# EAGLE design muscle_schematics (EAGLE 8.1.0)
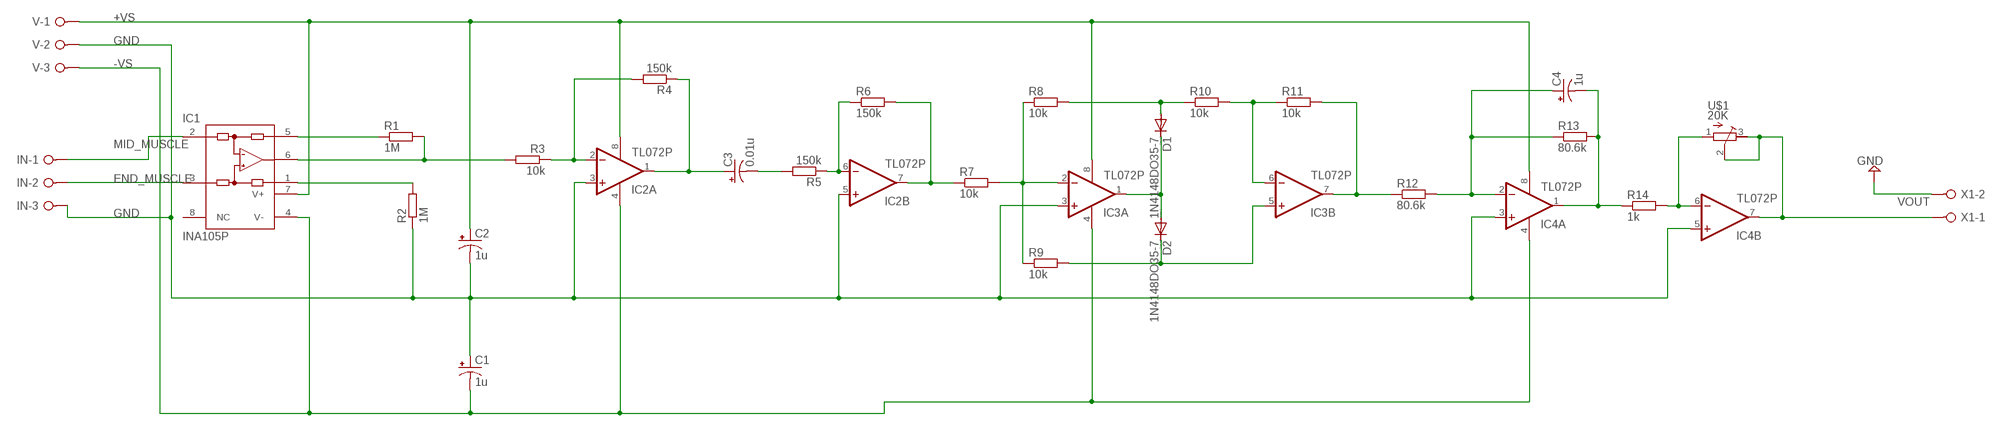
[diagram p0: schematic, sheet 1]

## Parts
C1  1u  CPOL-USE5-6  [E5-6]
C2  1u  CPOL-USE5-6  [E5-6]
C3  0.01u  CPOL-USE5-6  [E5-6]
C4  1u  CPOL-USE5-6  [E5-6]
D1  1N4148DO35-7  [DO35-7]
D2  1N4148DO35-7  [DO35-7]
IC1  INA105P  [DIL08]
IC2  TL072P  [DIL08]
IC3  TL072P  [DIL08]
IC4  TL072P  [DIL08]
IN  W237-3E  [W237-3E]
R1  1M  R-EU_0207/10  [0207/10]
R2  1M  R-EU_0207/10  [0207/10]
R3  10k  R-EU_0207/10  [0207/10]
R4  150k  R-EU_0207/10  [0207/10]
R5  150k  R-EU_0207/10  [0207/10]
R6  150k  R-EU_0207/10  [0207/10]
R7  10k  R-EU_0207/10  [0207/10]
R8  10k  R-EU_0207/10  [0207/10]
R9  10k  R-EU_0207/10  [0207/10]
R10  10k  R-EU_0207/10  [0207/10]
R11  10k  R-EU_0207/10  [0207/10]
R12  80.6k  R-EU_0207/10  [0207/10]
R13  80.6k  R-EU_0207/10  [0207/10]
R14  1k  R-EU_0207/10  [0207/10]
U$1  20K  R-TRIMM3339P  [RTRIM3339P]
V  W237-3E  [W237-3E]
X1  W237-02P  [W237-132]

## Nets
+VS: C2.+ IC1.7(V+) IC2.8(P:V+) IC3.8(P:V+) IC4.8(P:V+) V.1
-VS: C1.- IC1.4(V-) IC2.4(P:V-) IC3.4(P:V-) IC4.4(P:V-) V.3
END_MUSCLE: IC1.3(+IN) IN.2
GND: C1.+ C2.- IC2.3(A:+IN) IC2.5(B:+IN) IC3.3(A:+IN) IC4.3(A:+IN) IC4.5(B:+IN) IN.3 R2.1 V.2 X1.2
MID_MUSCLE: IC1.2(-IN) IN.1
N$1: IC1.5(SENSE) R1.1
N$2: IC1.6(OUT) R1.2 R3.2
N$3: IC1.1(REF) R2.2
N$4: C3.+ IC2.1(A:OUT) R4.1
N$5: C3.- R5.2
N$6: IC2.2(A:-IN) R3.1 R4.2
N$7: IC2.6(B:-IN) R5.1 R6.1
N$8: IC3.6(B:-IN) R10.2 R11.1
N$9: IC3.2(A:-IN) R7.2 R8.1 R9.1
N$10: D1.A R8.2 R10.1
N$13: D2.C IC3.5(B:+IN) R9.2
N$14: IC2.7(B:OUT) R6.2 R7.1
N$15: IC3.7(B:OUT) R11.2 R12.1
N$17: D1.C D2.A IC3.1(A:OUT)
N$18: C4.+ IC4.2(A:-IN) R12.2 R13.1
N$19: IC4.6(B:-IN) R14.2 U$1.1(A)
N$20: C4.- IC4.1(A:OUT) R13.2 R14.1
VOUT: IC4.7(B:OUT) U$1.2(S) U$1.3(E) X1.1
Unconnected: IC1.8(NC)

## Library data of the parts
C1-C4 = rcl:CPOL-US: POLARIZED CAPACITOR, American symbol
D1 D2 = diode:1N4148: DIODE high speed (Philips)
IC1 = burr-brown:INA105: Precision Unity Gain Diff. Amplifier; MF: TEXAS INSTRUMENTS; MPN: INA105KP; OC_FARNELL: 1651850; OC_NEWARK: 04M4538
IC2-IC4 = linear:TL072: OP AMP
IN V = con-wago-508:W237-3E: WAGO SREW CLAMP; OC_FARNELL: unknown; OC_NEWARK: unknown
R1-R14 = resistor:R-EU_: RESISTOR, European symbol
U$1 = resistor:R-TRIMM: Trimm resistor
X1 = con-wago-508:W237-02P: WAGO SREW CLAMP; OC_FARNELL: unknown; OC_NEWARK: unknown

## Board
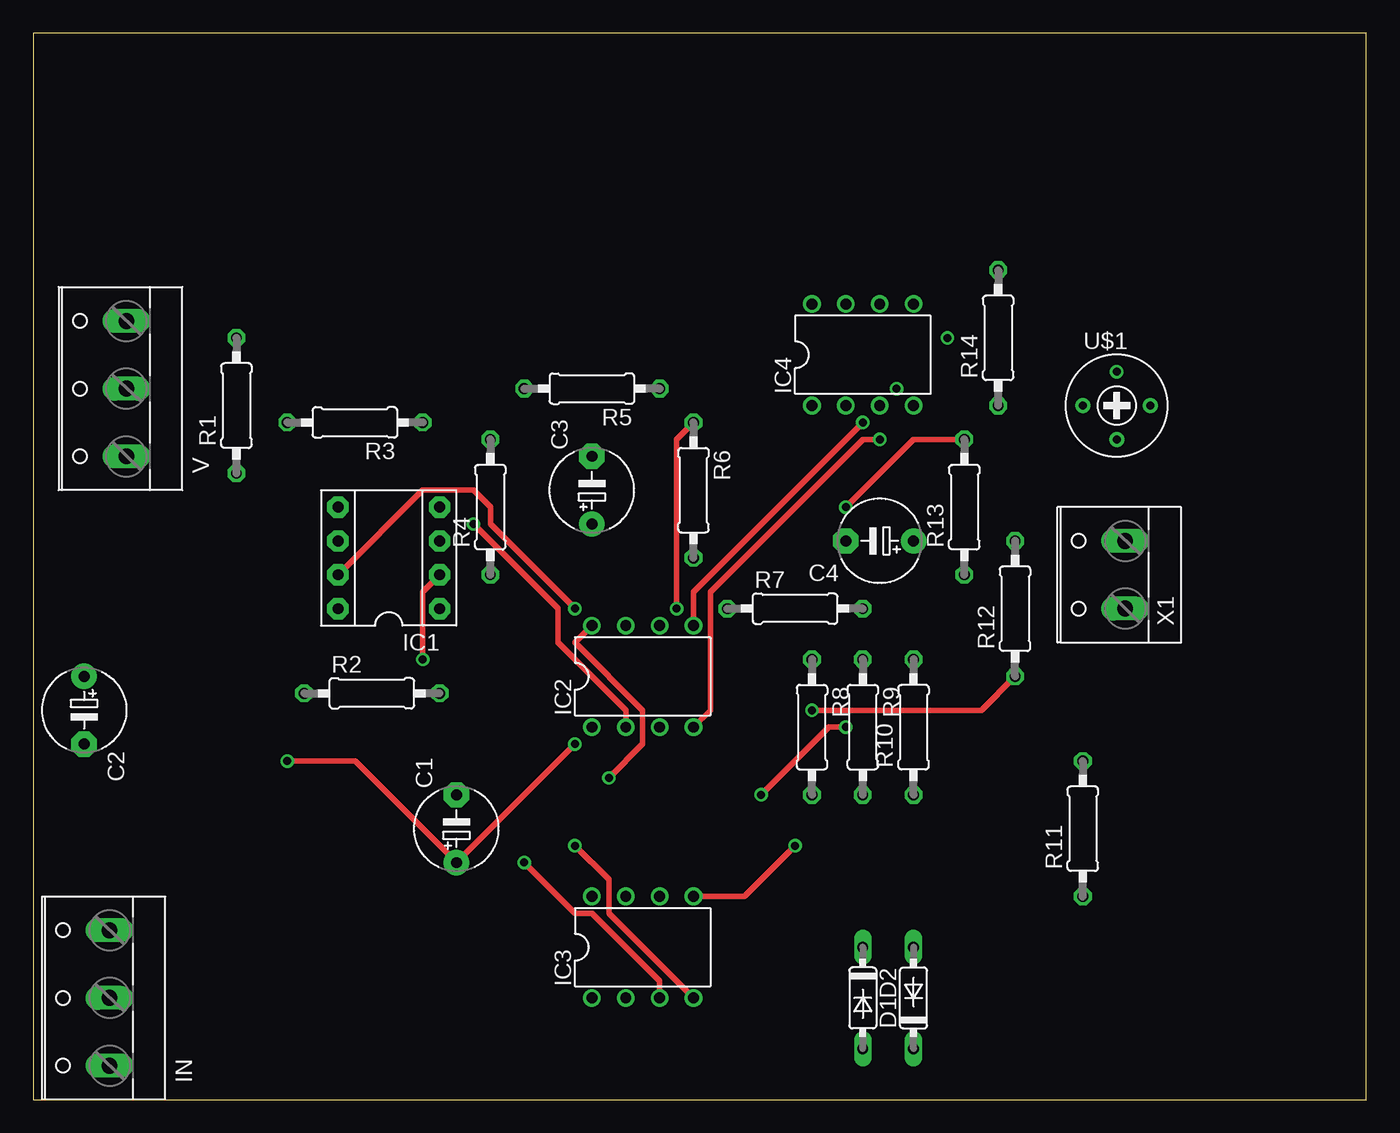
[diagram p1: board, top side]
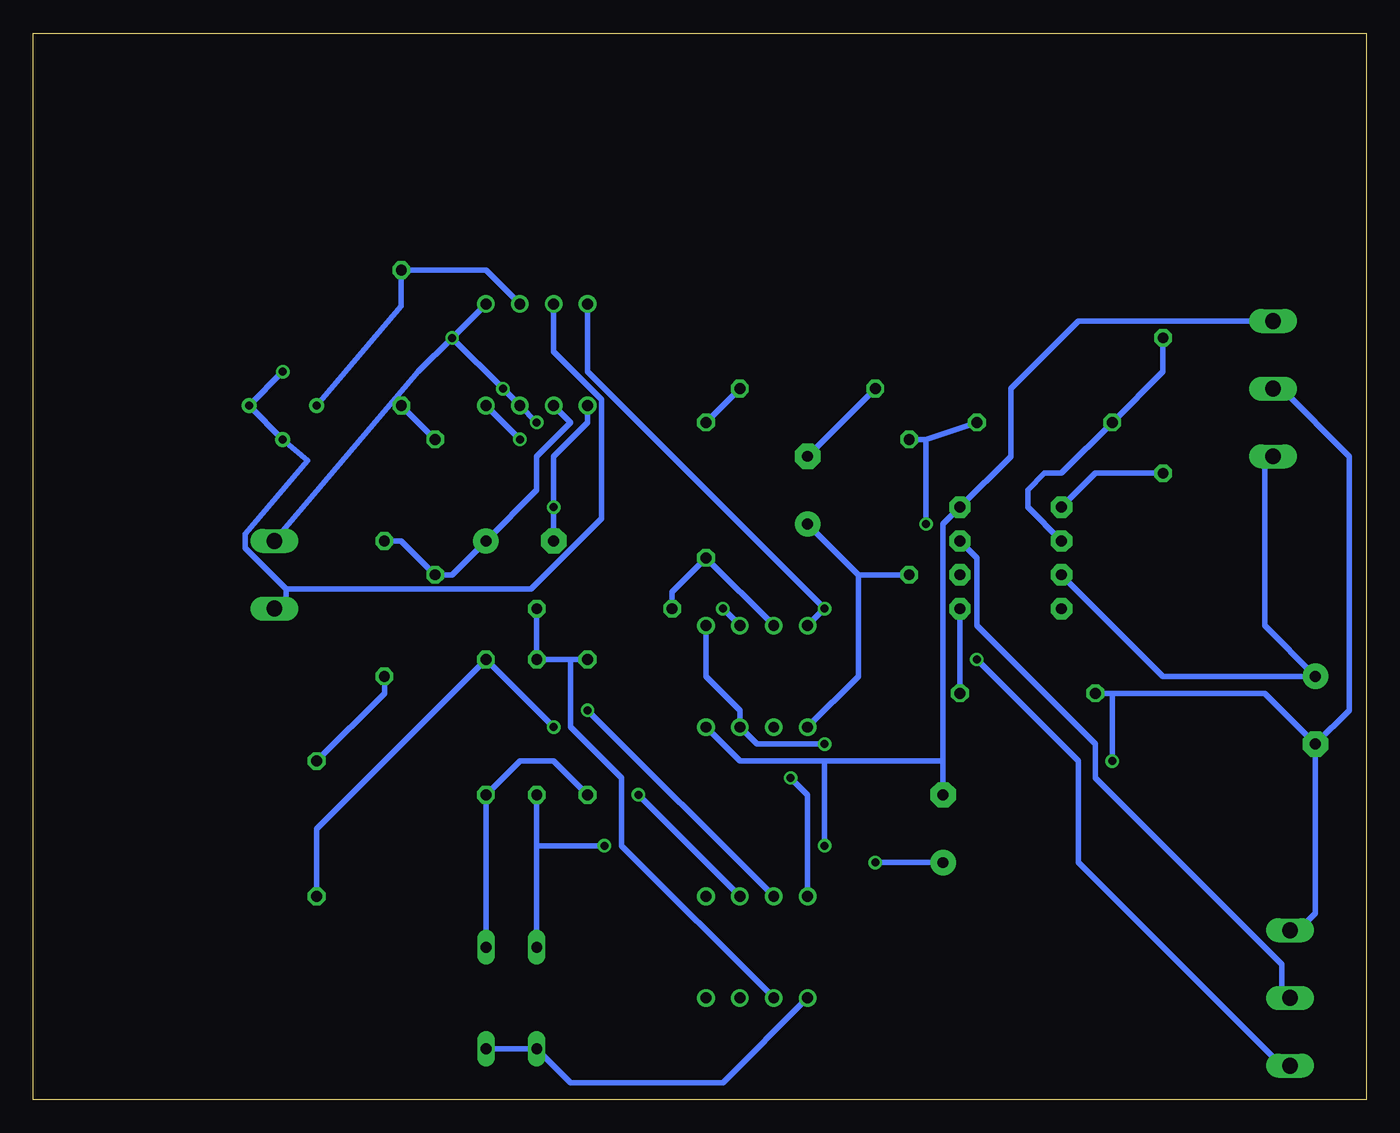
[diagram p2: board, bottom side, seen from below]

Size 100 x 80 mm. Coordinates in mm from the lower left corner, seen from the top.
Outline: 0,0 100,0 100,80 0,80 0,0
Copper layers (1*16): Top 0.035mm / dielectric 1.5mm / Bottom 0.035mm
Design rules "muscle_dru": minimum track width 10mil, minimum drill 24mil, track to track 8mil, track to pad 8mil, pad to pad 8mil, via to via 8mil, smd to smd 8mil, copper to edge 40mil, drill to drill 8mil, minimum pad ring 10mil, minimum via ring 8mil, stop-mask expansion 4mil, vias tented up to drill 0mil, thermal gap 10mil

### Footprints (pad centres in the part's own frame; a part is rotated, then mirrored left to right if it is on the bottom)
E5-6 = drill 0.813 pad 1.905: + -2.54,0 | drill 0.813 pad 1.905 octagon: - 2.54,0
DO35-7 = drill 0.813 long: A 3.81,0; C -3.81,0
DIL08 = drill 0.813 pad 1.6 octagon: 1 -3.81,-3.81; 2 -1.27,-3.81; 3 1.27,-3.81; 4 3.81,-3.81; 5 3.81,3.81; 6 1.27,3.81; 7 -1.27,3.81; 8 -3.81,3.81
DIL08' = drill 0.813 pad 1.27: 1 -3.81,-3.81; 2 -1.27,-3.81; 3 1.27,-3.81; 4 3.81,-3.81; 5 3.81,3.81; 6 1.27,3.81; 7 -1.27,3.81; 8 -3.81,3.81
W237-3E = drill 1.194 long: 1 -5.08,-0.635; 2 0,-0.635; 3 5.08,-0.635
0207/10 = drill 0.813 octagon: 1 -5.08,0; 2 5.08,0
RTRIM3339P = drill 0.61: 1 -2.54,0; 2 0,-2.54; 3 2.54,0
W237-132 = drill 1.194 long: 1 -2.54,-0.635; 2 2.54,-0.635

### Placement (x,y rotation side)
C1  31.75,20.32 90 top
C2  3.81,29.21 270 top
C3  41.91,45.72 90 top
C4  63.5,41.91 180 top
D1  66.04,7.62 90 top
D2  62.23,7.62 270 top
IC1  26.67,40.64 90 top
IC2  TL072P  [DIL08']  45.72,31.75 0 top
IC3  TL072P  [DIL08']  45.72,11.43 0 top
IC4  TL072P  [DIL08']  62.23,55.88 0 top
IN  5.08,7.62 90 top
R1  15.24,52.07 90 top
R2  25.4,30.48 0 top
R3  24.13,50.8 180 top
R4  34.29,44.45 90 top
R5  41.91,53.34 180 top
R6  49.53,45.72 270 top
R7  57.15,36.83 0 top
R8  58.42,27.94 270 top
R9  62.23,27.94 270 top
R10  66.04,27.94 90 top
R11  78.74,20.32 90 top
R12  73.66,36.83 90 top
R13  69.85,44.45 90 top
R14  72.39,57.15 90 top
U$1  81.28,52.07 0 top
V  6.35,53.34 90 top
X1  81.28,39.37 90 top

### Tracks (layer width: path | path; a pad name or v marks a point on that pad's centre or on a via)
+VS  (via drill 0.6)
  Top 0.406: v40.64,36.83 34.29,43.18 34.29,44.45 33.02,45.72 29.21,45.72 IC1.7 | v43.18,24.13 45.72,26.67 45.72,29.21 40.64,34.29 IC2.8
  Bottom 0.406: IC1.7 15.24,31.75 C2.+ 7.62,35.56 7.62,48.26 V.1 | IC2.8 v40.64,36.83 58.42,54.61 IC4.8 | IC3.8 41.91,22.86 v43.18,24.13
-VS  (via drill 0.6)
  Top 0.406: v63.5,49.53 62.23,49.53 50.8,38.1 50.8,29.21 IC2.4 | v40.64,19.05 43.18,16.51 43.18,13.97 IC3.4
  Bottom 0.406: C1.- 31.75,25.4 | 31.75,25.4 31.75,43.18 IC1.4 26.67,48.26 26.67,53.34 21.59,58.42 6.35,58.42 V.3 | 40.64,25.4 46.99,25.4 IC2.4 | 40.64,25.4 31.75,25.4 | v63.5,49.53 IC4.4 | v40.64,19.05 40.64,25.4
END_MUSCLE
  Bottom 0.406: IC1.3 29.21,40.64 29.21,35.56 20.32,26.67 20.32,24.13 6.35,10.16 6.35,7.62 IN.2
GND  (via drill 0.6)
  Top 0.406: v19.05,25.4 24.13,25.4 C1.+ v40.64,26.67 | v62.23,50.8 49.53,38.1 IC2.5 | v36.83,17.78 40.64,13.97 41.91,13.97 46.99,8.89 IC3.3
  Bottom 0.406: C2.- 3.81,13.97 5.08,12.7 IN.3 | 19.05,30.48 7.62,30.48 C2.- | 19.05,30.48 R2.1 | v19.05,25.4 19.05,30.48 | v40.64,26.67 45.72,26.67 IC2.3 46.99,29.21 49.53,31.75 IC2.5 | IC4.5 v68.58,57.15 | v62.23,50.8 IC4.3 v64.77,53.34 v68.58,57.15 | v36.83,17.78 C1.+ | 7.62,53.34 V.2 6.35,53.34 1.27,48.26 1.27,29.21 C2.- | X1.2 71.12,54.61 v68.58,57.15
MID_MUSCLE  (via drill 0.6)
  Top 0.406: v29.21,33.02 29.21,38.1 IC1.2
  Bottom 0.406: v29.21,33.02 21.59,25.4 21.59,17.78 6.35,2.54 IN.1
N$1
  Bottom 0.406: R1.1 20.32,46.99 IC1.5
N$2
  Bottom 0.406: IC1.6 25.4,44.45 25.4,45.72 24.13,46.99 22.86,46.99 R3.2 15.24,54.61 R1.2
N$3
  Bottom 0.406: R2.2 IC1.1
N$4
  Bottom 0.406: 38.1,39.37 R4.1 | C3.+ 38.1,39.37 | 38.1,39.37 38.1,31.75 IC2.1
N$5
  Bottom 0.406: R5.2 C3.-
N$6  (via drill 0.6)
  Top 0.406: v33.02,43.18 39.37,36.83 39.37,34.29 44.45,29.21 IC2.2
  Bottom 0.406: R3.1 33.02,49.53 | 33.02,49.53 R4.2 | v33.02,43.18 33.02,49.53
N$7  (via drill 0.6)
  Top 0.406: v48.26,36.83 48.26,49.53 R6.1
  Bottom 0.406: R5.1 R6.1 | v48.26,36.83 IC2.6
N$8  (via drill 0.6)
  Top 0.406: v54.61,22.86 59.69,27.94 v60.96,27.94
  Bottom 0.406: R11.1 78.74,20.32 R10.2 v60.96,27.94 | v54.61,22.86 IC3.6
N$9
  Bottom 0.406: R7.2 R9.1 59.69,33.02 | 59.69,33.02 R8.1 | IC3.2 55.88,19.05 55.88,24.13 59.69,27.94 59.69,33.02
N$10
  Bottom 0.406: R8.2 60.96,25.4 63.5,25.4 R10.1 D1.A
N$13  (via drill 0.6)
  Top 0.406: v57.15,19.05 53.34,15.24 IC3.5
  Bottom 0.406: R9.2 62.23,19.05 | 62.23,19.05 D2.C | v57.15,19.05 62.23,19.05
N$14
  Bottom 0.406: IC2.7 R6.2 52.07,38.1 R7.1
N$15  (via drill 0.6)
  Top 0.406: v58.42,29.21 71.12,29.21 R12.1
  Bottom 0.406: R11.2 73.66,30.48 R12.1 | v58.42,29.21 IC3.7
N$17
  Bottom 0.406: IC3.1 48.26,1.27 59.69,1.27 D2.A D1.C
N$18
  Bottom 0.406: IC4.2 59.69,50.8 62.23,48.26 62.23,45.72 C4.+ 68.58,39.37 R13.1 72.39,41.91 R12.2
N$19
  Bottom 0.406: IC4.6 66.04,62.23 R14.2 72.39,59.54 U$1.1
N$20  (via drill 0.6)
  Top 0.406: v60.96,44.45 66.04,49.53 R13.2
  Bottom 0.406: C4.- v60.96,44.45 60.96,48.26 58.42,50.8 IC4.1 | R14.1 R13.2
VOUT  (via drill 0.6)
  Bottom 0.406: IC4.7 60.96,56.12 57.35,52.51 57.35,43.59 62.65,38.3 81.05,38.3 | 81.05,38.3 84.11,41.37 84.11,42.45 79.43,47.96 U$1.2 U$1.3 v81.28,54.61 | X1.1 81.05,37.7 81.05,38.3